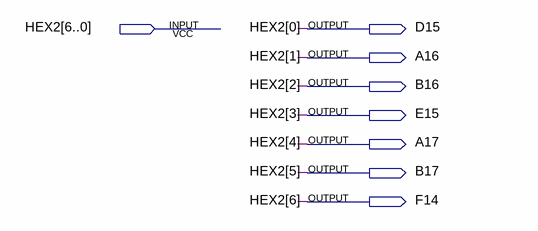
[diagram p0: schematic sheet]
// Quartus schematic Display2.bdf as structural Verilog: 0 symbols, 8 pins
module Display2 (
  input  [6:0] HEX2,
  output D15,
  output A16,
  output B16,
  output E15,
  output A17,
  output B17,
  output F14
);


  assign A16 = HEX2[1];
  assign A17 = HEX2[4];
  assign B16 = HEX2[2];
  assign B17 = HEX2[5];
  assign D15 = HEX2[0];
  assign E15 = HEX2[3];
  assign F14 = HEX2[6];
endmodule
